# Altium schematic sheet 00_BLBB_Overview.SchDoc
size A4; SheetNumber: 1; SheetTotal: 4
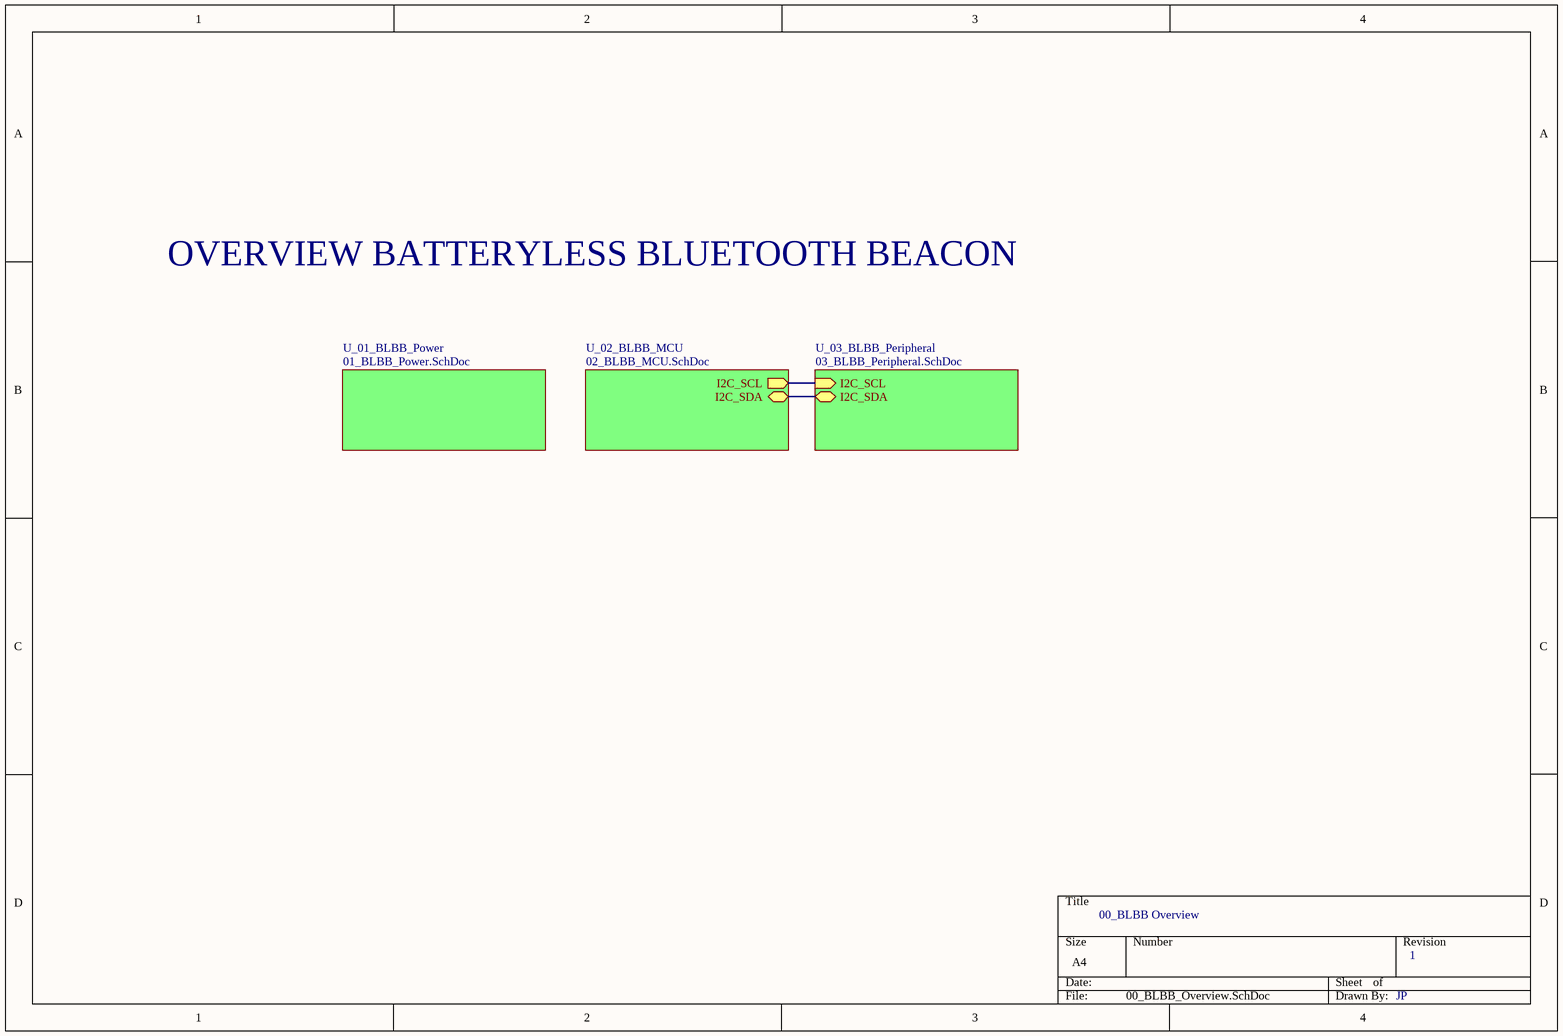
[diagram p0: 00_BLBB_Overview.SchDoc]

## Sub-sheets
U_01_BLBB_Power = 01_BLBB_Power.SchDoc: no entries
U_02_BLBB_MCU = 02_BLBB_MCU.SchDoc: I2C_SCL (out), I2C_SDA (bidir)
U_03_BLBB_Peripheral = 03_BLBB_Peripheral.SchDoc: I2C_SCL (in), I2C_SDA (bidir)

## Nets
(unnamed): sheet U_02_BLBB_MCU/I2C_SCL, sheet U_03_BLBB_Peripheral/I2C_SCL
(unnamed): sheet U_02_BLBB_MCU/I2C_SDA, sheet U_03_BLBB_Peripheral/I2C_SDA

## Notes on the sheet
- OVERVIEW BATTERYLESS BLUETOOTH BEACON
- 00_BLBB Overview
- 1
- JP